# EAGLE design Lixieuhr-Segment (EAGLE 7.7.0)
PROJEKT_NAME: Hautplatine; REVISION: V01; SCH_SHEET_NAME: Lixieuhr; USER_NAME: Akpinar Eren
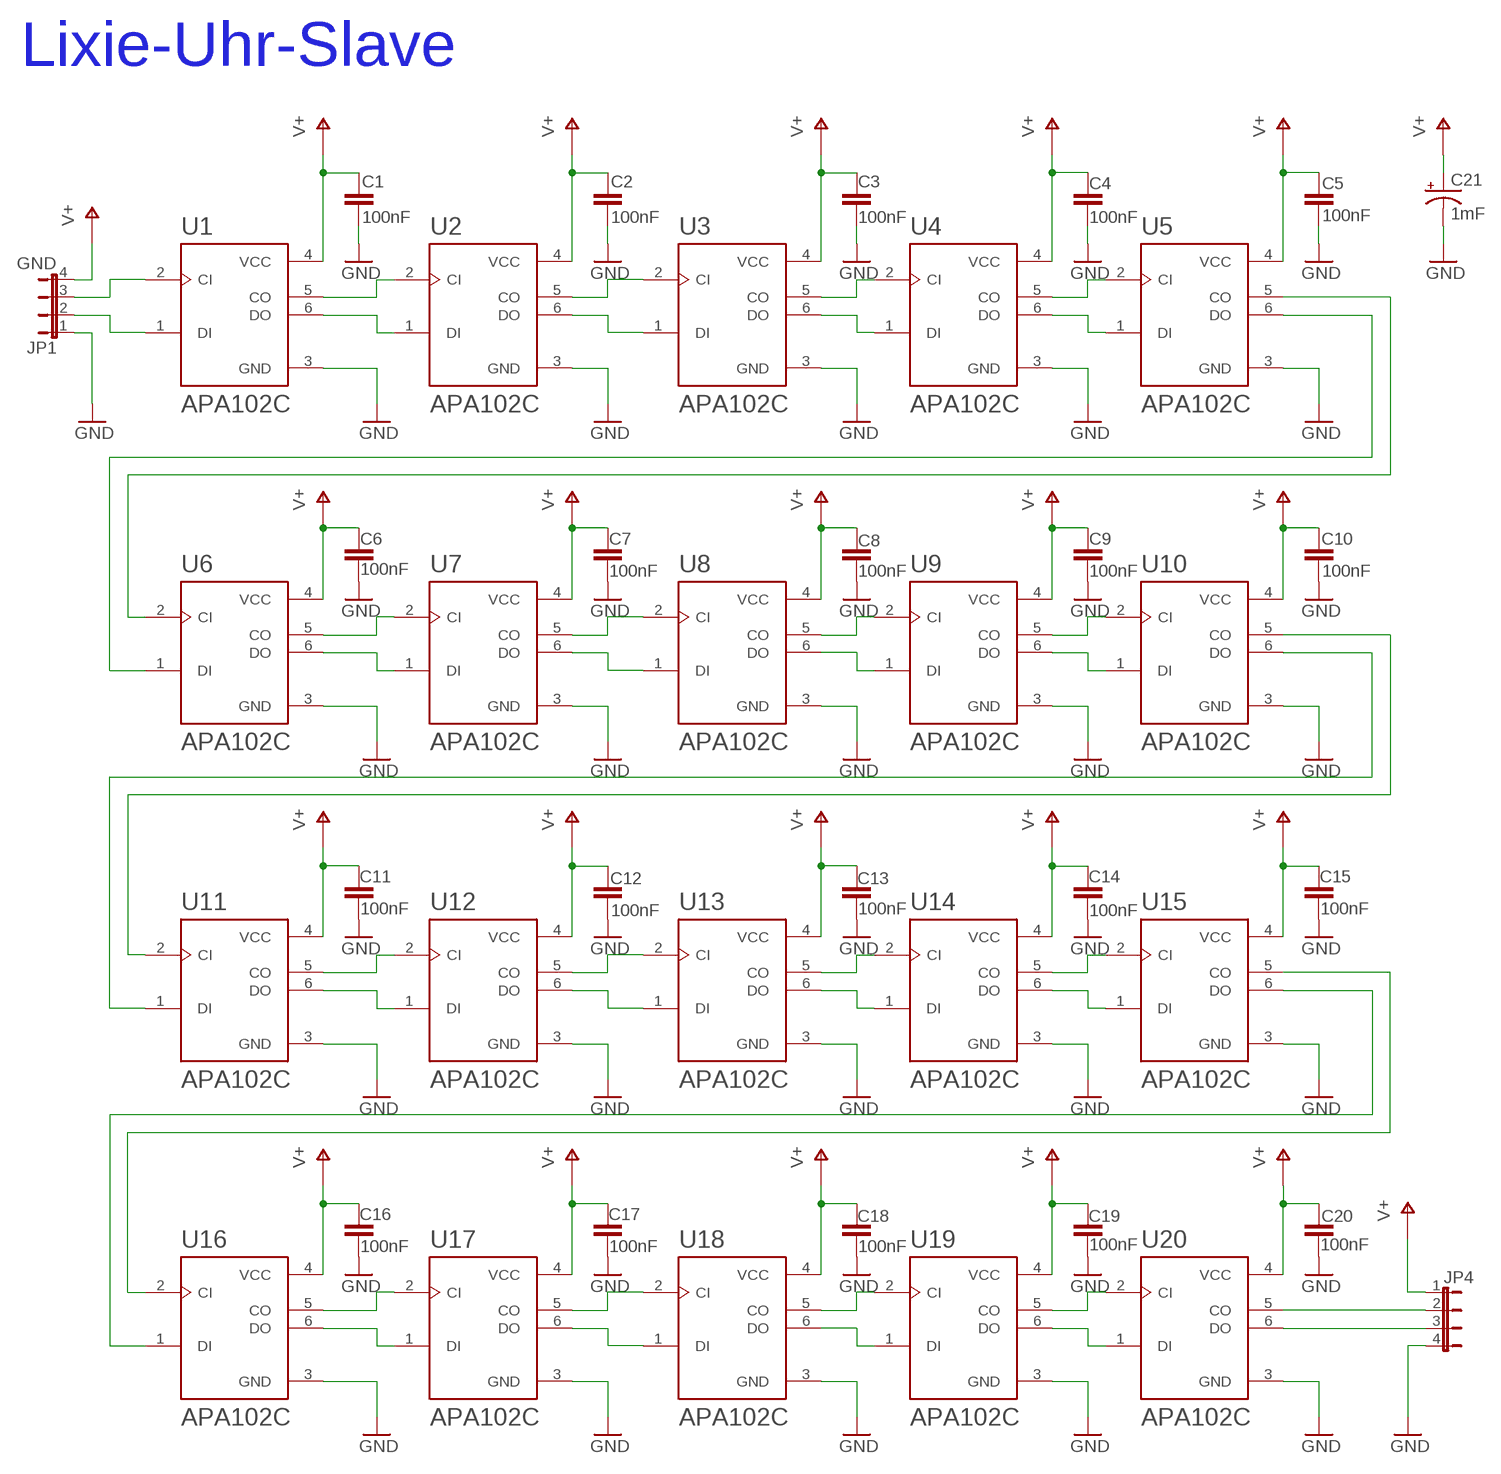
[diagram p0: schematic, sheet 1]

## Parts
C1  100nF  C-0805  [C0805]
C2  100nF  C-0805  [C0805]
C3  100nF  C-0805  [C0805]
C4  100nF  C-0805  [C0805]
C5  100nF  C-0805  [C0805]
C6  100nF  C-0805  [C0805]
C7  100nF  C-0805  [C0805]
C8  100nF  C-0805  [C0805]
C9  100nF  C-0805  [C0805]
C10  100nF  C-0805  [C0805]
C11  100nF  C-0805  [C0805]
C12  100nF  C-0805  [C0805]
C13  100nF  C-0805  [C0805]
C14  100nF  C-0805  [C0805]
C15  100nF  C-0805  [C0805]
C16  100nF  C-0805  [C0805]
C17  100nF  C-0805  [C0805]
C18  100nF  C-0805  [C0805]
C19  100nF  C-0805  [C0805]
C20  100nF  C-0805  [C0805]
C21  1mF  CPOL-USE3.5-8  [E3,5-8]
JP1  GND  JP4E  [JP4]
JP4  JP4E  [JP4]
U1  APA102C  [SON160P500X500X140-6N]
U2  APA102C  [SON160P500X500X140-6N]
U3  APA102C  [SON160P500X500X140-6N]
U4  APA102C  [SON160P500X500X140-6N]
U5  APA102C  [SON160P500X500X140-6N]
U6  APA102C  [SON160P500X500X140-6N]
U7  APA102C  [SON160P500X500X140-6N]
U8  APA102C  [SON160P500X500X140-6N]
U9  APA102C  [SON160P500X500X140-6N]
U10  APA102C  [SON160P500X500X140-6N]
U11  APA102C  [SON160P500X500X140-6N]
U12  APA102C  [SON160P500X500X140-6N]
U13  APA102C  [SON160P500X500X140-6N]
U14  APA102C  [SON160P500X500X140-6N]
U15  APA102C  [SON160P500X500X140-6N]
U16  APA102C  [SON160P500X500X140-6N]
U17  APA102C  [SON160P500X500X140-6N]
U18  APA102C  [SON160P500X500X140-6N]
U19  APA102C  [SON160P500X500X140-6N]
U20  APA102C  [SON160P500X500X140-6N]

## Nets
GND: C1.1 C2.1 C3.1 C4.1 C5.1 C6.1 C7.1 C8.1 C9.1 C10.1 C11.1 C12.1 C13.1 C14.1 C15.1 C16.1 C17.1 C18.1 C19.1 C20.1 C21.- JP1.1 JP4.4 U1.3(GND) U2.3(GND) U3.3(GND) U4.3(GND) U5.3(GND) U6.3(GND) U7.3(GND) U8.3(GND) U9.3(GND) U10.3(GND) U11.3(GND) U12.3(GND) U13.3(GND) U14.3(GND) U15.3(GND) U16.3(GND) U17.3(GND) U18.3(GND) U19.3(GND) U20.3(GND)
N$1: U1.5(CO) U2.2(CI)
N$2: U2.5(CO) U3.2(CI)
N$3: U3.5(CO) U4.2(CI)
N$4: U4.5(CO) U5.2(CI)
N$5: JP1.2 U1.1(DI)
N$6: U6.5(CO) U7.2(CI)
N$7: U7.5(CO) U8.2(CI)
N$8: U8.5(CO) U9.2(CI)
N$9: U9.5(CO) U10.2(CI)
N$10: U1.6(DO) U2.1(DI)
N$11: U2.6(DO) U3.1(DI)
N$12: U3.6(DO) U4.1(DI)
N$13: U4.6(DO) U5.1(DI)
N$15: U9.6(DO) U10.1(DI)
N$16: U6.6(DO) U7.1(DI)
N$17: U7.6(DO) U8.1(DI)
N$18: U8.6(DO) U9.1(DI)
N$19: U5.5(CO) U6.2(CI)
N$20: JP1.3 U1.2(CI)
N$21: U10.5(CO) U11.2(CI)
N$22: U10.6(DO) U11.1(DI)
N$23: U11.5(CO) U12.2(CI)
N$24: U12.5(CO) U13.2(CI)
N$25: U13.5(CO) U14.2(CI)
N$26: U14.5(CO) U15.2(CI)
N$27: U16.5(CO) U17.2(CI)
N$28: U17.5(CO) U18.2(CI)
N$29: U18.5(CO) U19.2(CI)
N$30: U19.5(CO) U20.2(CI)
N$31: U11.6(DO) U12.1(DI)
N$32: U12.6(DO) U13.1(DI)
N$33: U13.6(DO) U14.1(DI)
N$34: U14.6(DO) U15.1(DI)
N$36: U19.6(DO) U20.1(DI)
N$37: U16.6(DO) U17.1(DI)
N$38: U17.6(DO) U18.1(DI)
N$39: U18.6(DO) U19.1(DI)
N$43: JP4.2 U20.5(CO)
N$44: JP4.3 U20.6(DO)
N$46: U5.6(DO) U6.1(DI)
N$47: U15.5(CO) U16.2(CI)
N$48: U15.6(DO) U16.1(DI)
V+: C1.2 C2.2 C3.2 C4.2 C5.2 C6.2 C7.2 C8.2 C9.2 C10.2 C11.2 C12.2 C13.2 C14.2 C15.2 C16.2 C17.2 C18.2 C19.2 C20.2 C21.+ JP1.4 JP4.1 U1.4(VCC) U2.4(VCC) U3.4(VCC) U4.4(VCC) U5.4(VCC) U6.4(VCC) U7.4(VCC) U8.4(VCC) U9.4(VCC) U10.4(VCC) U11.4(VCC) U12.4(VCC) U13.4(VCC) U14.4(VCC) U15.4(VCC) U16.4(VCC) U17.4(VCC) U18.4(VCC) U19.4(VCC) U20.4(VCC)

## Notes on the sheet
- Lixie-Uhr-Slave

## Library data of the parts
C1-C20 = 0_HTL_MegaCard_V3:C: Capacitor
C21 = rcl:CPOL-US: POLARIZED CAPACITOR, American symbol
JP1 JP4 = jumper:JP4E: JUMPER
U1-U20 = APA102C:APA102C: RGB Full Color LED control IC Check availability <https://pricing.snapeda.com/parts/APA102C/Shiji%20Lighting/view-part?ref=eda>; AVAILABILITY: Not in stock; DESCRIPTION: Addressable Lighting - 1 LED Discrete Serial Red, Green, Blue (RGB) 5.00mm L x 5.00mm W; MF: Shiji Lighting; MP: APA102C; PACKAGE: SMD-6 Shiji Lightning; PRICE: None

## Board
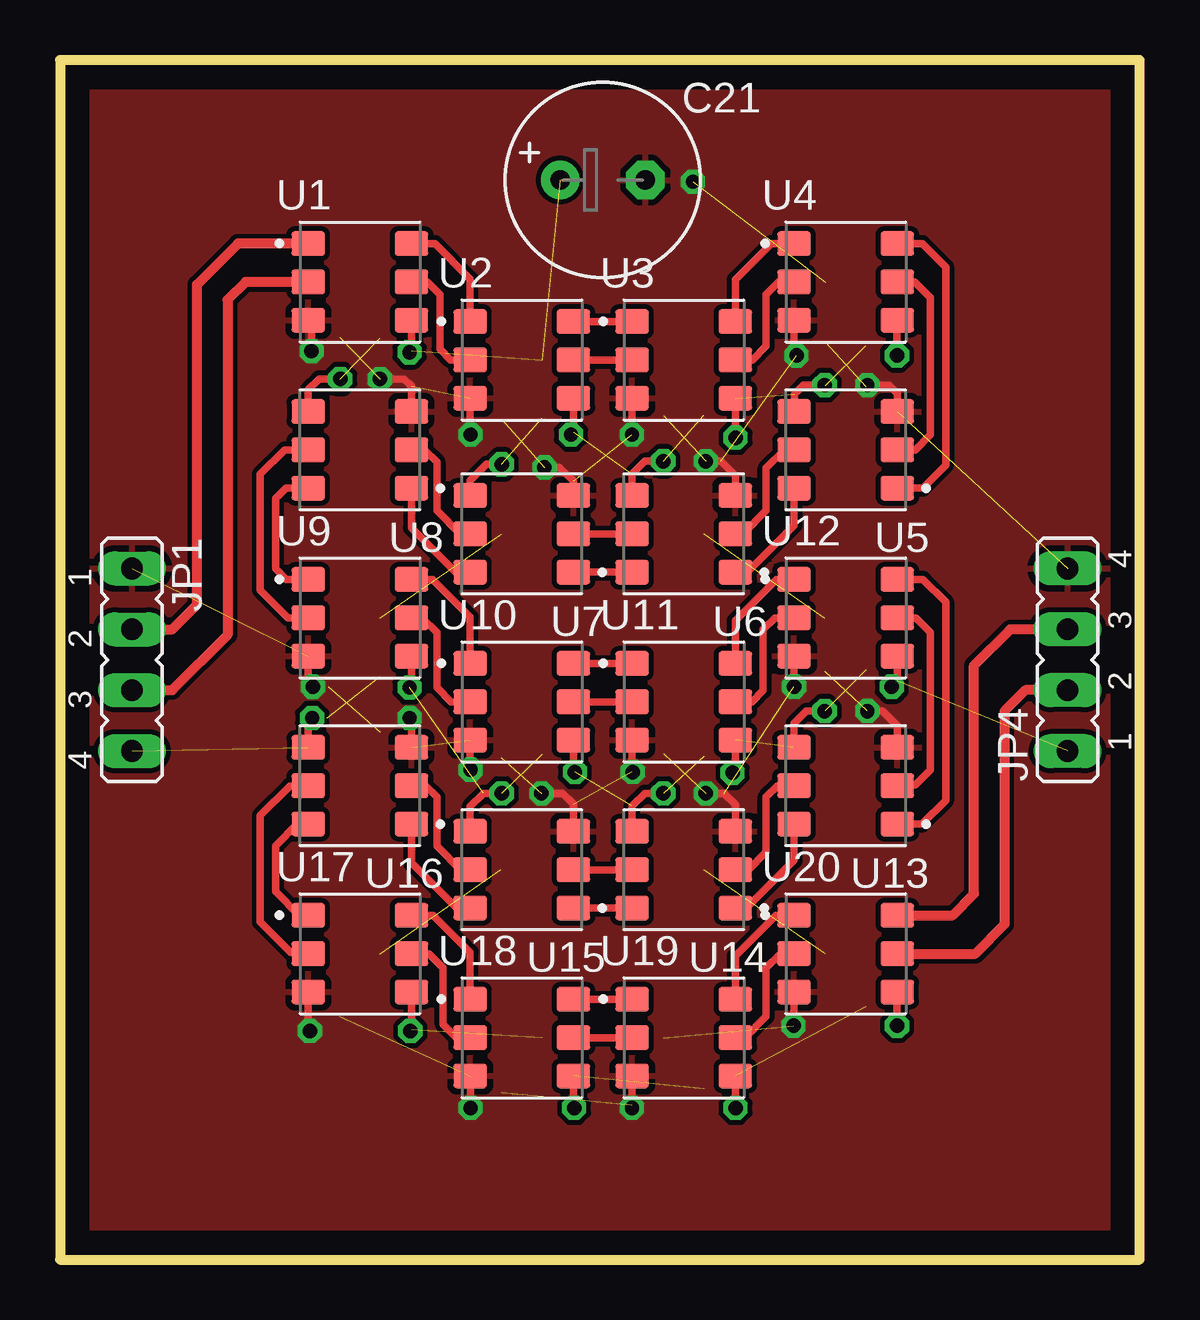
[diagram p1: board, top side]
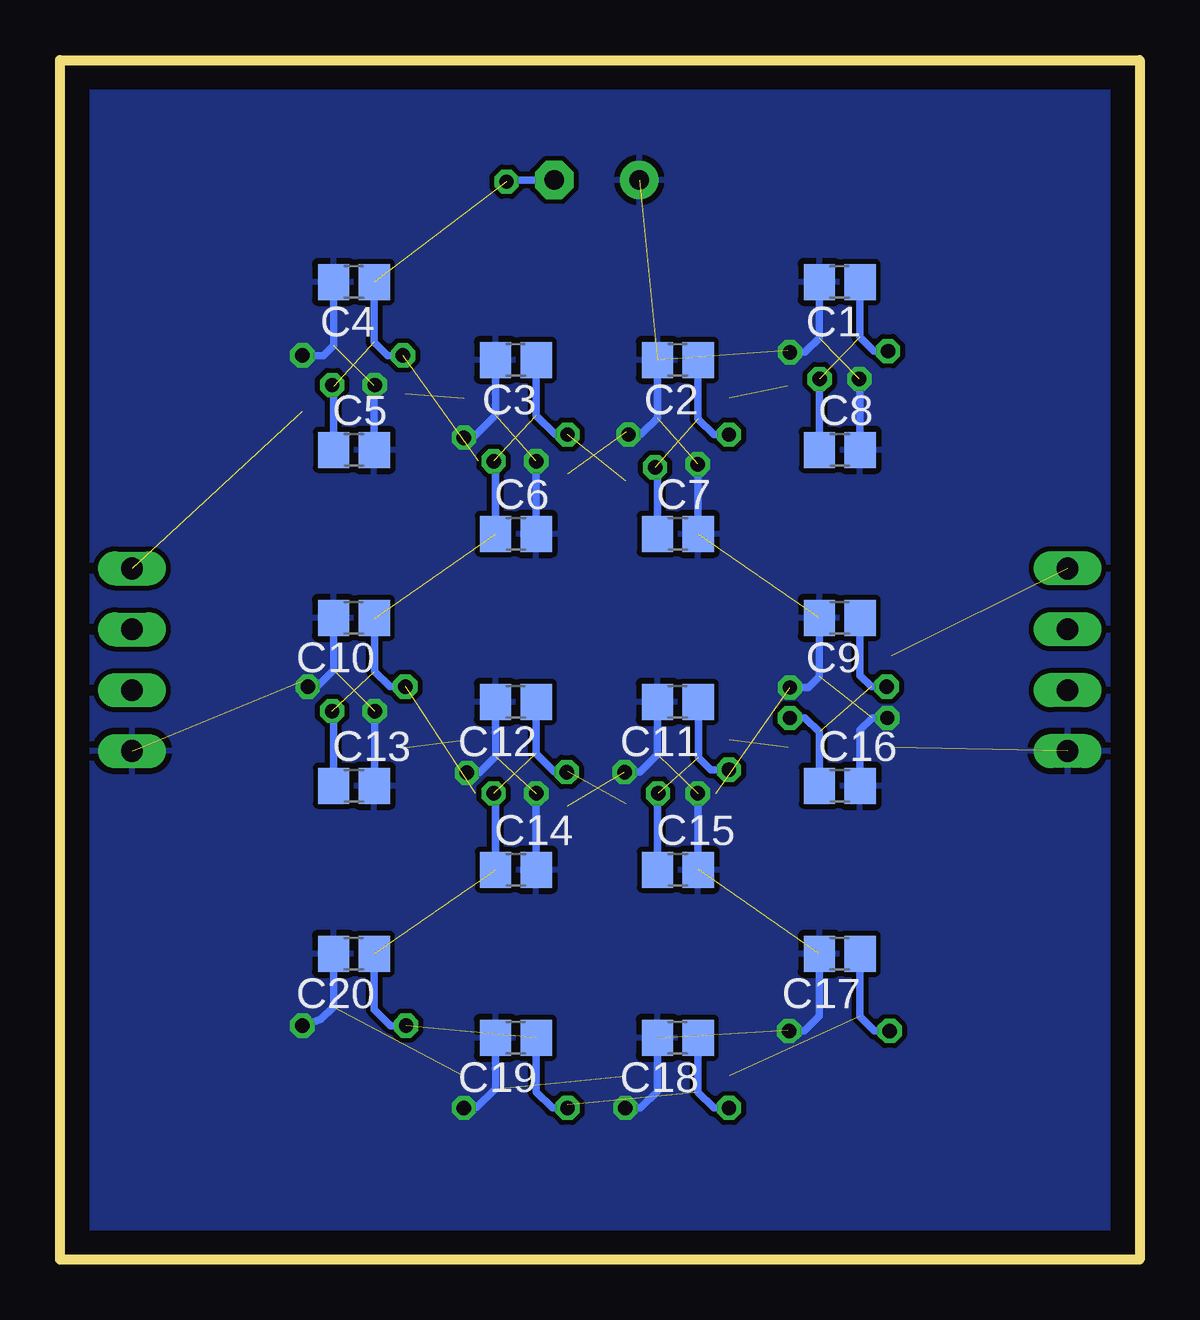
[diagram p2: board, bottom side, seen from below]

Size 45 x 50 mm. Coordinates in mm from the lower left corner, seen from the top.
Outline: 0,0 45,0 45,50 0,50 0,0
Copper layers (1*16): Top 0.035mm / dielectric 1.5mm / Bottom 0.035mm
Design rules "default *": minimum track width 10mil, minimum drill 15mil, track to track 8mil, track to pad 8mil, pad to pad 8mil, via to via 8mil, smd to smd 8mil, copper to edge 40mil, drill to drill 8mil, minimum pad ring 10mil, minimum via ring 8mil, stop-mask expansion 4mil, vias tented up to drill 0mil, thermal gap 10mil

### Footprints (pad centres in the part's own frame; a part is rotated, then mirrored left to right if it is on the bottom)
C0805 = smd 1.3 x 1.5: 1 -0.85,0; 2 0.85,0
E3,5-8 = drill 0.813 pad 1.6: + -1.778,0 | drill 0.813 pad 1.6 octagon: - 1.778,0
JP4 = drill 0.914 long: 1 -3.81,0; 2 -1.27,0; 3 1.27,0; 4 3.81,0
SON160P500X500X140-6N = smd 1.41 x 1.03: 1 -2.15,1.6; 2 -2.15,0; 3 -2.15,-1.6; 4 2.15,-1.6; 5 2.15,0; 6 2.15,1.6

### Placement (x,y rotation side)
C1  12.5,40.75 180 bottom
C2  19.25,37.5 180 bottom
C3  26,37.5 180 bottom
C4  32.75,40.75 180 bottom
C5  32.75,33.75 0 bottom
C6  26,30.25 0 bottom
C7  19.25,30.25 0 bottom
C8  12.5,33.75 0 bottom
C9  12.5,26.75 180 bottom
C10  32.75,26.75 180 bottom
C11  19.25,23.25 180 bottom
C12  26,23.25 180 bottom
C13  32.75,19.75 0 bottom
C14  26,16.25 0 bottom
C15  19.25,16.25 0 bottom
C16  12.5,19.75 0 bottom
C17  12.5,12.75 180 bottom
C18  19.25,9.25 180 bottom
C19  26,9.25 180 bottom
C20  32.75,12.75 180 bottom
C21  22.62,45 0 top
JP1  3,25 270 top
JP4  42,25 90 top
U1  12.5,40.75 0 top
U2  19.25,37.5 0 top
U3  26,37.5 0 top
U4  32.75,40.75 0 top
U5  32.75,33.75 180 top
U6  26,30.25 180 top
U7  19.25,30.25 180 top
U8  12.5,33.75 180 top
U9  12.5,26.75 0 top
U10  19.25,23.25 0 top
U11  26,23.25 0 top
U12  32.75,26.75 0 top
U13  32.75,19.75 180 top
U14  26,16.25 180 top
U15  19.25,16.25 180 top
U16  12.5,19.75 180 top
U17  12.5,12.75 0 top
U18  19.25,9.25 0 top
U19  26,9.25 0 top
U20  32.75,12.75 0 top

### Tracks (layer width: path | path; a pad name or v marks a point on that pad's centre or on a via)
GND  (via drill 0.6)  (22 unrouted)
  Top 0.305: U2.3 17.1,34.4 v17.11,34.38 | U3.3 v23.85,34.39 v23.84,34.38 | U4.3 30.6,37.79 v30.7,37.69 | U19.3 23.85,6.45 v23.84,6.32 | v17.11,6.32 17.11,7.64 U18.3 | U10.3 17.1,20.43 v17.11,20.41 | U16.3 14.65,22.5 v14.57,22.57 | U20.3 30.6,9.77 v30.57,9.75 | U17.3 10.35,9.59 v10.41,9.53 | U9.3 10.35,24.07 v10.54,23.88 | v10.48,37.87 10.48,39.02 U1.3 | v26.92,19.43 27.69,19.43 28.15,18.97 U14.3 | v33.66,22.86 34.29,22.86 34.9,22.25 U13.3 | v13.34,36.7 14.35,36.7 14.65,36.4 U8.3 | v20.19,33.02 20.83,33.02 21.4,32.45 U7.3 | v26.92,33.27 27.56,33.27 28.15,32.68 U6.3 | v33.66,36.45 34.54,36.45 34.9,36.09 U5.3 | v20.07,19.43 20.95,19.43 21.4,18.99 U15.3 | U11.3 23.85,20.35 v23.88,20.32 | U12.3 v30.6,23.88 v30.61,23.88
  Bottom 0.305: v17.11,34.38 17.75,34.38 18.4,35.04 C2.1 | v23.84,34.38 24.35,34.38 25.15,35.18 C3.1 | C21.- 26.31,45 v26.38,44.93 | v30.7,37.69 31.34,37.69 31.9,38.25 C4.1 | C20.1 31.9,10.44 31.21,9.75 v30.57,9.75 | C19.1 25.15,6.99 24.48,6.32 v23.84,6.32 | C18.1 18.4,6.97 17.75,6.32 v17.11,6.32 | 18.64,23.24 C11.1 18.38,23.24 18.38,20.92 17.88,20.41 v17.11,20.41 | v14.57,22.57 13.94,22.57 13.35,21.99 C16.1 | C9.1 11.65,24.35 11.18,23.88 v10.54,23.88 | C1.1 11.65,38.45 11.07,37.87 v10.48,37.87 | v10.41,9.53 11.05,9.53 11.65,10.13 C17.1 | C14.1 26.85,19.36 v26.92,19.43 | C13.1 33.6,22.8 v33.66,22.86 | C8.1 13.35,36.69 v13.34,36.7 | C7.1 20.1,32.93 v20.19,33.02 | C6.1 26.85,33.2 v26.92,33.27 | C5.1 33.6,36.39 v33.66,36.45 | C15.1 20.1,19.4 v20.07,19.43 | v23.88,20.32 24.38,20.32 25.15,21.09 C12.1 | v30.61,23.88 31.24,23.88 31.88,24.51 31.88,26.73 C10.1
  pour Top: 1,49 1,1 44,1 44,49
N$1
  Top 0.305: U1.5 15.32,40.75 15.84,40.23 15.84,37.94 16.28,37.5 U2.2
N$2
  Top 0.305: U2.5 U3.2
N$3
  Top 0.305: U4.2 29.95,40.75 29.43,40.23 29.43,38.07 28.86,37.5 U3.5
N$4
  Top 0.305: U5.2 35.66,33.75 36.29,34.38 36.29,40.1 35.64,40.75 U4.5
N$5
  Top 0.406: JP1.2 4.68,26.27 5.71,27.3 5.71,40.64 7.42,42.35 U1.1
N$6
  Top 0.305: U7.2 U6.5
N$7
  Top 0.305: U8.2 15.21,33.75 15.72,33.24 15.72,31.21 16.68,30.25 U7.5
N$8
  Top 0.305: U9.2 9.51,26.75 8.35,27.91 8.35,32.73 9.37,33.75 U8.5
N$9
  Top 0.305: U9.5 15.1,26.75 15.72,26.13 15.72,23.84 16.31,23.25 U10.2
N$10
  Top 0.305: U1.6 15.62,42.35 17.1,40.88 U2.1
N$11
  Top 0.305: U2.6 U3.1
N$12
  Top 0.305: U4.1 29.65,42.35 28.15,40.85 U3.6
N$13
  Top 0.305: U4.6 35.95,42.35 36.92,41.37 36.92,33.12 35.96,32.15 U5.1
N$15
  Top 0.305: U9.6 15.53,28.35 17.1,26.78 U10.1
N$16
  Top 0.305: U7.1 U6.6
N$17
  Top 0.305: U7.6 16.5,28.65 14.65,30.5 U8.1
N$18
  Top 0.305: U9.1 9.43,28.35 8.98,28.8 8.98,31.72 9.42,32.15 U8.6
N$19
  Top 0.305: U6.2 28.47,30.25 29.43,31.21 29.43,32.99 30.19,33.75 U5.5
N$20
  Top 0.406: U1.2 7.73,40.75 6.99,40.01 6.99,26.04 4.68,23.73 JP1.3
N$21
  Top 0.305: U10.5 U11.2
N$22
  Top 0.305: U10.6 U11.1
N$23
  Top 0.305: U12.2 29.8,26.75 29.3,26.26 29.3,23.72 28.84,23.25 U11.5
N$24
  Top 0.305: U12.5 35.67,26.75 36.29,26.13 36.29,20.41 35.66,19.78 34.93,19.78 U13.2
N$25
  Top 0.305: U14.2 28.7,16.25 29.43,16.99 29.43,19.27 29.91,19.75 U13.5
N$26
  Top 0.305: U15.2 U14.5
N$27
  Top 0.305: U16.5 9.59,19.75 8.35,18.51 8.35,14.06 9.62,12.79 10.3,12.79 U17.2
N$28
  Top 0.305: U18.2 16.53,9.25 15.97,9.81 15.97,12.16 15.38,12.75 U17.5
N$29
  Top 0.305: U18.5 U19.2
N$30
  Top 0.305: U20.2 30.02,12.75 29.43,12.16 29.43,10.13 28.55,9.25 U19.5
N$31
  Top 0.305: U12.1 29.87,28.35 28.15,26.63 U11.6
N$32
  Top 0.305: U12.6 35.98,28.35 36.92,27.4 36.92,19.14 35.93,18.15 U13.1
N$33
  Top 0.305: U14.1 28.62,14.65 30.6,16.63 U13.6
N$34
  Top 0.305: U15.1 U14.6
N$36
  Top 0.305: U19.6 28.15,12.66 29.84,14.35 U20.1
N$37
  Top 0.305: U16.6 9.89,18.15 8.98,17.24 8.98,15.34 9.97,14.35 U17.1
N$38
  Top 0.305: U17.6 15.56,14.35 17.1,12.81 U18.1
N$39
  Top 0.305: U18.6 U19.1
N$43
  Top 0.406: JP4.2 40.24,23.73 39.37,22.86 39.37,13.97 38.15,12.75 U20.5
N$44
  Top 0.406: U20.6 37.21,14.35 38.1,15.24 38.1,24.77 39.6,26.27 JP4.3
N$46
  Top 0.305: U6.1 28.65,28.65 30.6,30.6 U5.6
N$47
  Top 0.305: U15.5 16.71,16.25 15.72,17.24 15.72,19.27 15.24,19.75 U16.2
N$48
  Top 0.305: U15.6 16.53,14.65 14.65,16.53 U16.1
V+  (via drill 0.6)  (22 unrouted)
  Top 0.305: U2.4 21.4,34.48 v21.3,34.38 | v28.16,34.26 28.16,35.89 U3.4 | v34.89,37.69 U4.4 | v34.89,9.75 U20.4 | U19.4 28.15,6.46 v28.16,6.32 | U18.4 21.4,6.48 v21.43,6.32 | U11.4 28.15,20.4 v28.04,20.29 | U16.4 10.35,22.41 v10.51,22.57 | U9.4 14.65,23.92 v14.57,23.84 | U1.4 14.65,37.89 v14.57,37.81 | U17.4 14.65,9.57 v14.61,9.53 | U15.4 17.1,18.88 17.65,19.43 v18.41,19.43 | U14.4 23.85,18.9 24.38,19.43 v25.15,19.43 | U13.4 30.6,22.34 31.11,22.86 v31.88,22.86 | U12.4 34.9,24.11 v34.67,23.88 | v11.68,36.7 10.79,36.7 10.35,36.26 U8.4 | v18.41,33.15 17.78,33.15 17.1,32.47 U7.4 | v25.15,33.27 24.38,33.27 23.85,32.74 U6.4 | v31.88,36.45 30.99,36.45 30.61,36.07 U5.4 | U10.4 21.4,20.38 v21.46,20.32
  Bottom 0.305: v21.3,34.38 20.8,34.38 20.1,35.08 C2.2 | C3.2 26.85,35.19 27.78,34.26 v28.16,34.26 | C4.2 33.6,38.09 34,37.69 v34.89,37.69 | C20.2 33.6,10.53 34.13,10 v34.89,9.75 | C19.2 26.85,7.12 27.65,6.32 v28.16,6.32 | C18.2 20.1,7.01 20.8,6.32 v21.43,6.32 | 18.38,16.27 C15.2 18.41,16.27 v18.41,19.43 | v28.04,20.29 27.53,20.29 26.85,20.96 C12.2 | C14.2 25.15,18.6 25.15,18.61 v25.15,19.43 | v10.51,22.57 11.14,22.57 11.65,22.07 C16.2 | C9.2 13.35,24.3 13.81,23.84 v14.57,23.84 | C8.2 11.65,36.67 v11.68,36.7 | v14.57,37.81 13.94,37.81 13.35,38.4 C1.2 | v14.61,9.53 13.97,9.53 13.34,10.16 13.34,12.73 C17.2 | v31.88,22.86 31.88,19.77 C13.2 | v34.67,23.88 34.29,23.88 33.6,24.57 C10.2 | C7.2 18.4,33.01 18.41,33.02 v18.41,33.15 | C6.2 v25.15,33.27 | C5.2 31.9,36.43 v31.88,36.45 | v21.46,20.32 20.83,20.32 20.1,21.05 C11.2
  pour Bottom: 1,49 1,1 44,1 44,49

### Text on the board
tDrill: Material: FR4 1,5mm 35u Cu | Toleranz: Aussenmass -0,5mm, sonst +/_0,2mm | Bohrplan | SYM | SIZE | CNT | 0.60 mm | 41 | 0.80 mm | 2 | 0.90 mm | 8 | TOTAL | 51
bDrill: Material: FR4 1,5mm 35u Cu | Toleranz: Aussenmass -0,5mm, sonst +/_0,2mm | Bohrplan | CNT | SIZE | SYM | 41 | 0.60 mm | 2 | 0.80 mm | 8 | 0.91 mm | 51 | TOTAL